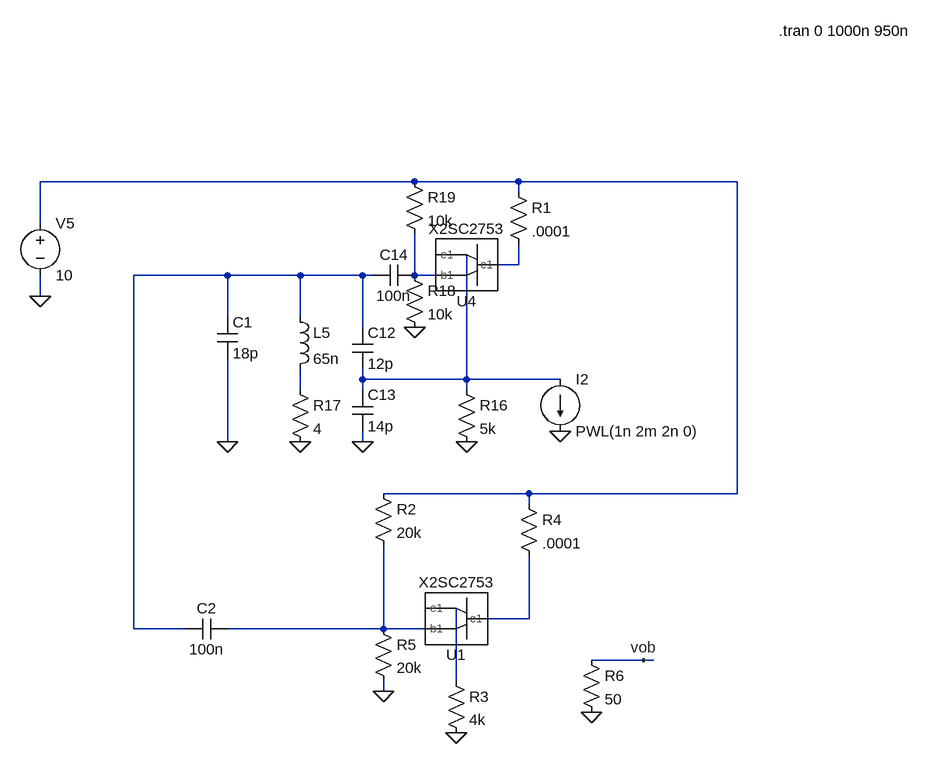
[diagram p0: schematic Oscillator.asc]
Oscillator.asc, the LTspice schematic file:
Version 4
SHEET 1 2276 1772
WIRE 944 880 368 880
WIRE 1104 880 944 880
WIRE 1440 880 1104 880
WIRE 1104 896 1104 880
WIRE 368 944 368 880
WIRE 1024 992 976 992
WIRE 1104 1008 1104 976
WIRE 1104 1008 1072 1008
WIRE 656 1024 512 1024
WIRE 768 1024 656 1024
WIRE 864 1024 768 1024
WIRE 880 1024 864 1024
WIRE 944 1024 944 960
WIRE 976 1024 944 1024
WIRE 368 1056 368 1024
WIRE 656 1088 656 1024
WIRE 768 1088 768 1024
WIRE 864 1104 864 1024
WIRE 864 1184 864 1168
WIRE 1024 1184 1024 992
WIRE 1024 1184 864 1184
WIRE 1168 1184 1024 1184
WIRE 768 1200 768 1168
WIRE 864 1200 864 1184
WIRE 1024 1200 1024 1184
WIRE 656 1280 656 1152
WIRE 864 1280 864 1264
WIRE 1120 1360 896 1360
WIRE 1440 1360 1440 880
WIRE 1440 1360 1120 1360
WIRE 1120 1376 1120 1360
WIRE 1008 1536 960 1536
WIRE 1120 1552 1120 1456
WIRE 1120 1552 1056 1552
WIRE 512 1568 512 1024
WIRE 592 1568 512 1568
WIRE 896 1568 896 1440
WIRE 896 1568 656 1568
WIRE 960 1568 896 1568
WIRE 1296 1616 1216 1616
WIRE 1312 1616 1296 1616
WIRE 1008 1648 1008 1536
WIRE 896 1664 896 1648
FLAG 368 1056 0
FLAG 1168 1264 0
FLAG 1024 1280 0
FLAG 768 1280 0
FLAG 864 1280 0
FLAG 944 1104 0
FLAG 656 1280 0
FLAG 1008 1728 0
FLAG 1296 1616 vob
FLAG 896 1664 0
FLAG 1216 1696 0
SYMBOL AutoGenerated\\X2SC2753 1024 1008 R180
SYMATTR InstName U4
SYMBOL voltage 368 928 R0
WINDOW 123 0 0 Left 0
WINDOW 39 0 0 Left 0
SYMATTR InstName V5
SYMATTR Value 10
SYMBOL current 1168 1184 R0
WINDOW 123 0 0 Left 0
WINDOW 39 0 0 Left 0
SYMATTR InstName I2
SYMATTR Value PWL(1n 2m 2n 0)
SYMBOL res 1008 1184 R0
SYMATTR InstName R16
SYMATTR Value 5k
SYMBOL ind 752 1072 R0
SYMATTR InstName L5
SYMATTR Value 65n
SYMBOL res 752 1184 R0
SYMATTR InstName R17
SYMATTR Value 4
SYMBOL cap 848 1104 R0
SYMATTR InstName C12
SYMATTR Value 12p
SYMBOL cap 848 1200 R0
SYMATTR InstName C13
SYMATTR Value 14p
SYMBOL cap 944 1008 R90
WINDOW 0 0 32 VBottom 2
WINDOW 3 32 32 VTop 2
SYMATTR InstName C14
SYMATTR Value 100n
SYMBOL res 928 1008 R0
SYMATTR InstName R18
SYMATTR Value 10k
SYMBOL res 928 864 R0
SYMATTR InstName R19
SYMATTR Value 10k
SYMBOL res 1088 880 R0
SYMATTR InstName R1
SYMATTR Value .0001
SYMBOL cap 640 1088 R0
SYMATTR InstName C1
SYMATTR Value 18p
SYMBOL AutoGenerated\\X2SC2753 1008 1552 R180
SYMATTR InstName U1
SYMBOL cap 656 1552 R90
WINDOW 0 0 32 VBottom 2
WINDOW 3 32 32 VTop 2
SYMATTR InstName C2
SYMATTR Value 100n
SYMBOL res 880 1344 R0
SYMATTR InstName R2
SYMATTR Value 20k
SYMBOL res 992 1632 R0
SYMATTR InstName R3
SYMATTR Value 4k
SYMBOL res 880 1552 R0
SYMATTR InstName R5
SYMATTR Value 20k
SYMBOL res 1104 1360 R0
SYMATTR InstName R4
SYMATTR Value .0001
SYMBOL res 1200 1600 R0
SYMATTR InstName R6
SYMATTR Value 50
TEXT 1504 648 Left 2 !.tran 0 1000n 950n

The netlist it stands for:
* Oscillator.asc
XU4 N003 N005 N002 X2SC2753  ; pins c1 b1 e1
V5 N001 0 10
I2 N002 0 PWL(1n 2m 2n 0)
R16 N002 0 5k
L5 N004 N006 65n
R17 N006 0 4
C12 N004 N002 12p
C13 N002 0 14p
C14 N005 N004 100n
R18 N005 0 10k
R19 N001 N005 10k
R1 N001 N003 .0001
C1 N004 0 18p
XU1 N008 N009 N007 X2SC2753  ; pins c1 b1 e1
C2 N009 N004 100n
R2 N001 N009 20k
R3 N007 0 4k
R5 N009 0 20k
R4 N001 N008 .0001
R6 vob 0 50
.tran 0 1000n 950n
.lib C:/Users/jonathansharir-smith/Desktop/251SPICE/Lab2/narrowband\2SC2753.lib
.backanno
.end